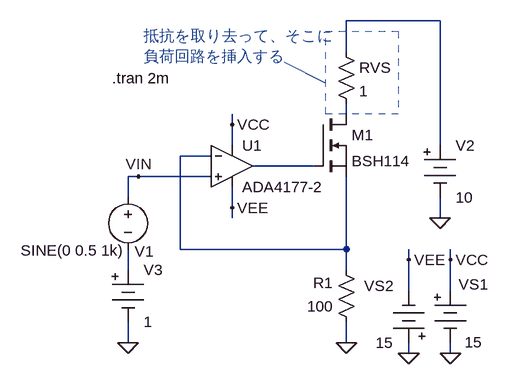
[diagram p0: schematic fig-01-02-29.asc]
fig-01-02-29.asc, the LTspice schematic file:
Version 4
SHEET 1 880 680
WIRE 528 -48 384 -48
WIRE 384 0 384 -48
WIRE 384 96 384 80
WIRE 208 112 208 96
WIRE 208 144 208 112
WIRE 528 144 528 -48
WIRE 176 160 128 160
WIRE 336 176 240 176
WIRE 64 192 48 192
WIRE 176 192 64 192
WIRE 48 224 48 192
WIRE 208 240 208 208
WIRE 208 256 208 240
WIRE 528 256 528 224
WIRE 128 304 128 160
WIRE 384 304 384 192
WIRE 384 304 128 304
WIRE 480 320 480 304
WIRE 544 320 544 304
WIRE 48 336 48 304
WIRE 384 336 384 304
WIRE 480 368 480 320
WIRE 544 368 544 320
WIRE 48 448 48 416
WIRE 384 448 384 416
WIRE 480 464 480 448
WIRE 544 464 544 448
FLAG 384 448 0
FLAG 48 448 0
FLAG 64 192 VIN
FLAG 528 256 0
FLAG 480 464 0
FLAG 544 464 0
FLAG 480 320 VEE
FLAG 544 320 VCC
FLAG 208 112 VCC
FLAG 208 240 VEE
SYMBOL res 400 432 R180
WINDOW 0 36 76 Left 2
WINDOW 3 36 40 Left 2
SYMATTR InstName R1
SYMATTR Value 100
SYMBOL voltage 48 208 R0
WINDOW 0 10 99 Left 2
WINDOW 3 -165 98 Left 2
WINDOW 123 0 0 Left 0
WINDOW 39 0 0 Left 0
SYMATTR InstName V1
SYMATTR Value SINE(0 0.5 1k)
SYMBOL Misc\\battery 528 128 R0
WINDOW 123 0 0 Left 0
WINDOW 39 0 0 Left 0
SYMATTR InstName V2
SYMATTR Value 10
SYMBOL Misc\\battery 48 320 R0
WINDOW 123 0 0 Left 0
WINDOW 39 0 0 Left 0
SYMATTR InstName V3
SYMATTR Value 1
SYMBOL Misc\\battery 544 352 R0
WINDOW 0 13 6 Left 2
WINDOW 3 22 95 Left 2
SYMATTR InstName VS1
SYMATTR Value 15
SYMBOL Misc\\battery 480 464 R180
WINDOW 0 24 104 Left 2
WINDOW 3 24 16 Left 2
SYMATTR InstName VS2
SYMATTR Value 15
SYMBOL nmos 336 96 R0
SYMATTR InstName M1
SYMATTR Value BSH114
SYMBOL res 368 -16 R0
SYMATTR InstName RVS
SYMATTR Value 1
SYMBOL Opamps\\ADA4177-2 208 176 R0
SYMATTR InstName U1
TEXT 24 40 Left 2 !.tran 2m
TEXT 72 -24 Left 2 ;抵抗を取り去って、そこに\n負荷回路を挿入する
LINE Normal 288 16 352 48
RECTANGLE Normal 464 96 352 -32 2

The netlist it stands for:
* fig-01-02-29.asc
R1 0 N003 100
V1 VIN N005 SINE(0 0.5 1k)
V2 N001 0 10
V3 N005 0 1
VS1 VCC 0 15
VS2 0 VEE 15
M1 N002 N004 N003 N003 BSH114
RVS N001 N002 1
* U1: ADA4177-2 (symbol Opamps\ADA4177-2 not available, pins judged from their places): In+=VIN In-=N003 V+=VCC V-=VEE OUT=N004
.model NMOS NMOS
.model PMOS PMOS
.lib standard.mos
.tran 2m
* 抵抗を取り去って、そこに
* 負荷回路を挿入する
.backanno
.end